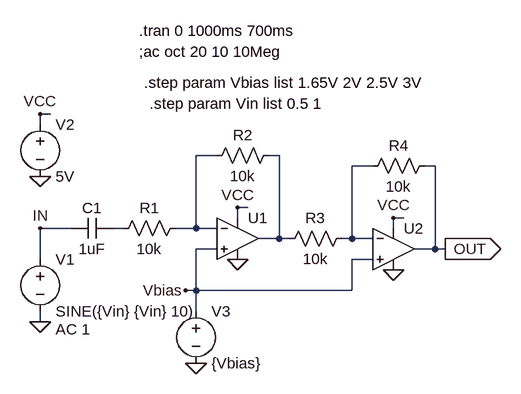
[diagram p0: schematic ArduinoLFO_Bias__Amp_Test.asc]
ArduinoLFO_Bias__Amp_Test.asc, the LTspice schematic file:
Version 4
SHEET 1 1208 680
WIRE 144 -96 128 -96
WIRE 128 -80 128 -96
WIRE 400 -32 368 -32
WIRE 496 -32 480 -32
WIRE 640 -16 608 -16
WIRE 736 -16 720 -16
WIRE 448 48 432 48
WIRE 432 64 432 48
WIRE 688 64 672 64
WIRE 176 80 128 80
WIRE 256 80 240 80
WIRE 368 80 368 -32
WIRE 368 80 336 80
WIRE 400 80 368 80
WIRE 672 80 672 64
WIRE 496 96 496 -32
WIRE 496 96 464 96
WIRE 512 96 496 96
WIRE 608 96 608 -16
WIRE 608 96 592 96
WIRE 640 96 608 96
WIRE 400 112 368 112
WIRE 736 112 736 -16
WIRE 736 112 704 112
WIRE 752 112 736 112
WIRE 128 128 128 80
WIRE 640 128 608 128
WIRE 368 176 368 112
WIRE 368 176 352 176
WIRE 608 176 608 128
WIRE 608 176 368 176
WIRE 368 208 368 176
WIRE 128 224 128 208
FLAG 128 224 0
FLAG 432 48 VCC
FLAG 432 128 0
FLAG 752 112 OUT
IOPIN 752 112 Out
FLAG 128 0 0
FLAG 128 -96 VCC
FLAG 352 176 Vbias
FLAG 128 80 IN
FLAG 368 288 0
FLAG 672 64 VCC
FLAG 672 144 0
SYMBOL voltage 128 112 R0
WINDOW 123 24 124 Left 2
WINDOW 39 0 0 Left 2
SYMATTR Value2 AC 1
SYMATTR InstName V1
SYMATTR Value SINE({Vin} {Vin} 10)
SYMBOL res 352 64 R90
WINDOW 0 0 56 VBottom 2
WINDOW 3 32 56 VTop 2
SYMATTR InstName R1
SYMATTR Value 10k
SYMBOL Opamps\\UniversalOpamp2 432 96 R0
SYMATTR InstName U1
SYMBOL voltage 128 -96 R0
WINDOW 123 0 0 Left 2
WINDOW 39 0 0 Left 2
SYMATTR InstName V2
SYMATTR Value 5V
SYMBOL res 496 -48 R90
WINDOW 0 0 56 VBottom 2
WINDOW 3 32 56 VTop 2
SYMATTR InstName R2
SYMATTR Value 10k
SYMBOL cap 240 64 R90
WINDOW 0 0 32 VBottom 2
WINDOW 3 32 32 VTop 2
SYMATTR InstName C1
SYMATTR Value 1uF
SYMBOL voltage 368 192 R0
SYMATTR InstName V3
SYMATTR Value {Vbias}
SYMBOL Opamps\\UniversalOpamp2 672 112 R0
SYMATTR InstName U2
SYMBOL res 608 80 R90
WINDOW 0 0 56 VBottom 2
WINDOW 3 32 56 VTop 2
SYMATTR InstName R3
SYMATTR Value 10k
SYMBOL res 736 -32 R90
WINDOW 0 0 56 VBottom 2
WINDOW 3 32 56 VTop 2
SYMATTR InstName R4
SYMATTR Value 10k
TEXT 280 -224 Left 2 !.tran 0 1000ms 700ms
TEXT 288 -144 Left 2 !.step param Vbias list 1.65V 2V 2.5V 3V
TEXT 280 -192 Left 2 !;ac oct 20 10 10Meg
TEXT 296 -112 Left 2 !.step param Vin list 0.5 1

The netlist it stands for:
* ArduinoLFO_Bias__Amp_Test.asc
V1 IN 0 SINE({Vin} {Vin} 10) AC 1
R1 N001 N004 10k
XU1 Vbias N001 VCC 0 N002 level.2 Avol=1Meg GBW=10Meg Slew=10Meg ilimit=25m rail=0 Vos=0 phimargin=45 en=0 enk=0 in=0 ink=0 Rin=500Meg  ; pins IN+ IN- V+ V- OUT
V2 VCC 0 5V
R2 N002 N001 10k
C1 N004 IN 1uF
V3 Vbias 0 {Vbias}
XU2 Vbias N003 VCC 0 OUT level.2 Avol=1Meg GBW=10Meg Slew=10Meg ilimit=25m rail=0 Vos=0 phimargin=45 en=0 enk=0 in=0 ink=0 Rin=500Meg  ; pins IN+ IN- V+ V- OUT
R3 N003 N002 10k
R4 OUT N003 10k
.tran 0 1000ms 700ms
.step param Vbias list 1.65V 2V 2.5V 3V
;ac oct 20 10 10Meg
.step param Vin list 0.5 1
.lib UniversalOpamps2.sub
.backanno
.end